# Altium project Node_E73.PrjPcb
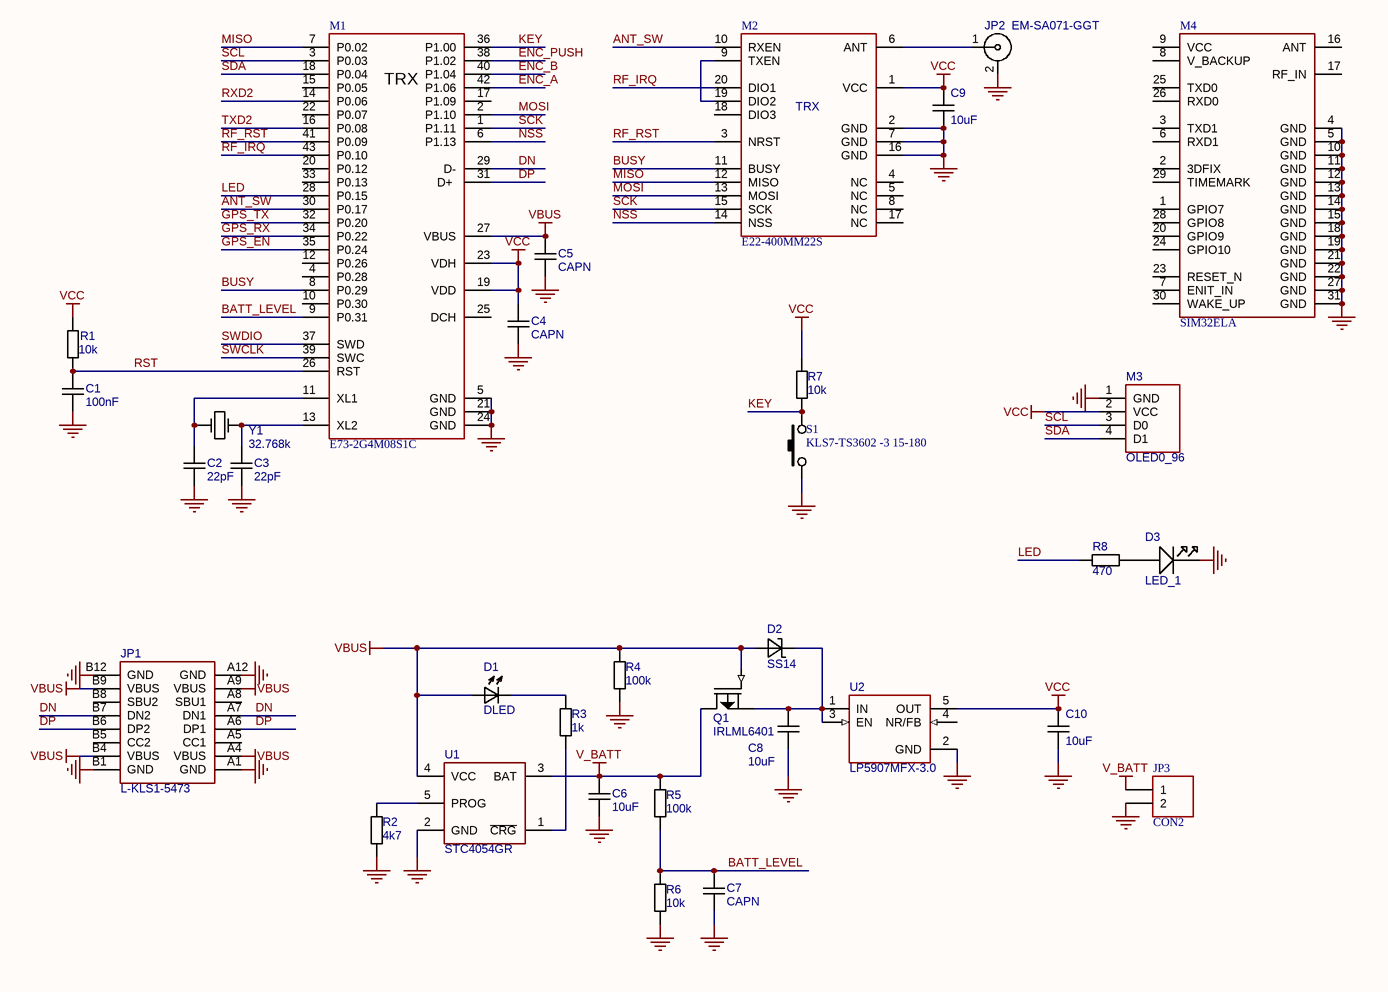
[diagram p0: E73N.SchDoc]
1 sheet, 33 parts. Net scope: global (net labels, ports and power ports of the same name join across sheets).
Board file: E73N.PcbDoc

## Sheet E73N.SchDoc
size 431 x 279 mm; SheetNumber: 1; SheetTotal: 1

### Parts
C1  100nF  [C-0603]
C2  22pF  [C-0603]
C3  22pF  [C-0603]
C4  CAPN  [C-0603]
C5  CAPN  [C-0603]
C6  10uF  [C-0805]
C7  CAPN  [C-0603]
C8  10uF  [C-0805]
C9  10uF  [C-0805]
C10  10uF  [C-0805]
D1  DLED  [LED_3mm_RED]
D2  SS14  [D-SMA]
D3  LED_1  [LED_0805]
JP1  L-KLS1-5473  [USB_C_SMD_SLOT]
JP2  EM-SA071-GGT  [SMA_F_EDGE]
JP3  CON2  [WH-02R]
M1  E73-2G4M08S1C  [E73-2G4M08S1CX]
M2  E22-400MM22S  [E290-XXXMM20S]
M3  OLED0_96  [OLED096_I2C]
M4  SIM32ELA  [LGA_SIM32]
Q1  IRLML6401  [SOT-23]
R1  10k  [R-0603]
R2  4k7  [R-0603]
R3  1k  [R-0603]
R4  100k  [R-0603]
R5  100k  [R-0603]
R6  10k  [R-0603]
R7  10k  [R-0603]
R8  470  [R-0603]
S1  KLS7-TS3602 -3 15-180  [KLS7-TS3602]
U1  STC4054GR  [SOT-23-5]
U2  LP5907MFX-3.0  [SOT-23-5]
Y1  32.768k  [KX-327]

### Nets
GND: C1.1 C2.1 C3.1 C4.2 C5.2 C6.2 C7.2 C8.2 C9.2 C10.2 D3.K(CATHODE) JP1.A1(GND) JP1.A12(GND) JP1.B1(GND) JP1.B12(GND) JP2.2 JP3.2 M1.5(GND) M1.21(GND) M1.24(GND) M2.2(GND) M2.7(GND) M2.16(GND) M3.1(GND) M4.4(GND) M4.5(GND) M4.10(GND) M4.11(GND) M4.12(GND) M4.13(GND) M4.14(GND) M4.15(GND) M4.18(GND) M4.19(GND) M4.21(GND) M4.22(GND) M4.27(GND) M4.31(GND) R2.1 R4.1 R6.1 S1.1 U1.2(GND) U2.2(GND)
V_BATT: C6.1 JP3.1 Q1.3(DRAIN) R5.2 U1.3(BAT)
VBUS: C5.1 D1.1 D2.1 JP1.A4(VBUS) JP1.A9(VBUS) JP1.B4(VBUS) JP1.B9(VBUS) M1.27(VBUS) Q1.1(GATE) R4.2 U1.4(VCC)
VCC: C4.1 C9.1 C10.1 M1.19(VDD) M1.23(VDH) M2.1(VCC) M3.2(VCC) R1.2 R7.1 U2.5(OUT)
ANT_SW: M1.30(P0.17) M2.10(RXEN)
BATT_LEVEL: C7.1 M1.9(P0.31) R5.1 R6.2
BUSY: M1.8(P0.29) M2.11(BUSY)
DN: JP1.A7(DN1) JP1.B7(DN2) M1.29(D-)
DP: JP1.A6(DP1) JP1.B6(DP2) M1.31(D+)
ENC_A: M1.42(P1.06)
ENC_B: M1.40(P1.04)
ENC_PUSH: M1.38(P1.02)
GPS_EN: M1.35(P0.24)
GPS_RX: M1.34(P0.22)
GPS_TX: M1.32(P0.20)
KEY: M1.36(P1.00) R7.2 S1.2
LED: M1.28(P0.15) R8.2
MISO: M1.7(P0.02) M2.12(MISO)
MOSI: M1.2(P1.10) M2.13(MOSI)
NSS: M1.6(P1.13) M2.14(NSS)
RF_IRQ: M1.43(P0.10) M2.20(DIO1)
RF_RST: M1.41(P0.09) M2.3(NRST)
RST: C1.2 M1.26(RST) R1.1
RXD2: M1.14(P0.06)
SCK: M1.1(P1.11) M2.15(SCK)
SCL: M1.3(P0.03) M3.3(D0)
SDA: M1.18(P0.04) M3.4(D1)
SWCLK: M1.39(SWC)
SWDIO: M1.37(SWD)
TXD2: M1.16(P0.08)
NetC2_2: C2.2 M1.11(XL1) Y1.2
NetC3_2: C3.2 M1.13(XL2) Y1.1
NetC8_1: C8.1 D2.2 Q1.2(SOURCE) U2.1(IN) U2.3(EN)
NetD1_2: D1.2 R3.2
NetD3_A: D3.A(ANODE) R8.1
NetJP2_1: JP2.1 M2.6(ANT)
NetM2_9: M2.9(TXEN) M2.19(DIO2)
NetR2_2: R2.2 U1.5(PROG)
NetR3_1: R3.1 U1.1(~{CRG})

Not connected (* = marked no-connect by the designer): JP1 17(VSS) A5(CC1) A8(SBU1) B5(CC2) B8(SBU2); M1 4(P0.28) 10(P0.30) 12(P0.26) 15(P0.05) 17(P1.09) 20(P0.12) 22(P0.07) 25(DCH) 33(P0.13); M2 4(NC) 5(NC) 8(NC) 17(NC) 18(DIO3); M4 1(GPIO7) 2(3DFIX) 3(TXD1) 6(RXD1) 7(ENIT_IN_) 8(V_BACKUP) 9(VCC) 16(ANT) 17(RF_IN) 20(GPIO9) 23(RESET_N) 24(GPIO10) 25(TXD0) 26(RXD0) 28(GPIO8) 29(TIMEMARK) 30(WAKE_UP_); U2 4(NR/FB)

### Notes on the sheet
- DWG. NO.
- REV.
- SHT.
- THIS DOCUMENT AND THE DATA DISCLOSED HEREIN OR HEREWITH IS THE PROPERTY OF ALTIUM LIMITED AND MAY BE FREELY DISTRIBUTED IN WHOLE. NO RIGHTS ARE RESERVED OR EXPRESS OR IMPLIED WARANTEE GIVEN.
- REVISION
- DESCRIPTION
- DATE
- APPROVED
- ENG:
- APPROVALS
- PROJECT
- DSN:
- CHK:
- REFERENCE DOCUMENTS
- PROJECT REVISION:
- TITLE
- DOCUMENT REVISION:
- DESIGN ITEM:
- BOM:
- FAB DWG:
- PCB DWG:
- ASSY DWG:
- SCALE:
- SIZE
- B
- CAGE CODE
- FILE NAME
- DWG NO.
- SHEET
- OF
- REV
- (in symbol E22-400MM22S) TRX
- (in symbol E73-2G4M08S1C) TRX

### Library data of the parts
C1-C10 = CAPN: Voltage: 50V; Точність/група: NP0; Вид: Конденсатор
D1 = DLED: Вид: Світлодіод
D2 = DIODSH: Вид: Діод
D3 = LED_1: Вид: Світлодіод
JP1 = L-KLS1-5473: Mounting  Method: SMD; Value: *
JP2 = SMA: SMA Female R/A PCB Mount; Вид: Роз'єм
JP3 = CON2: Вид: Роз'єм; *: *
M3 = OLED0_96_I2C
M4 = SIM32ELA: Вид: Модуль
Q1 = MOSF-P: Вид: Транзистор
R1-R8 = RES: Точність/група: 5%; Вид: Резистор
S1 = SW-1: Вид: Кнопка; Робоча напруга: *
U1 = STC4054
U2 = LP5907: 250mA Low-Dropout Regulator; Вид: Мікросхема
Y1 = Y: Точність/група: 20ppm; Вид: Кварц